# Altium schematic sheet Power.SchDoc
size A
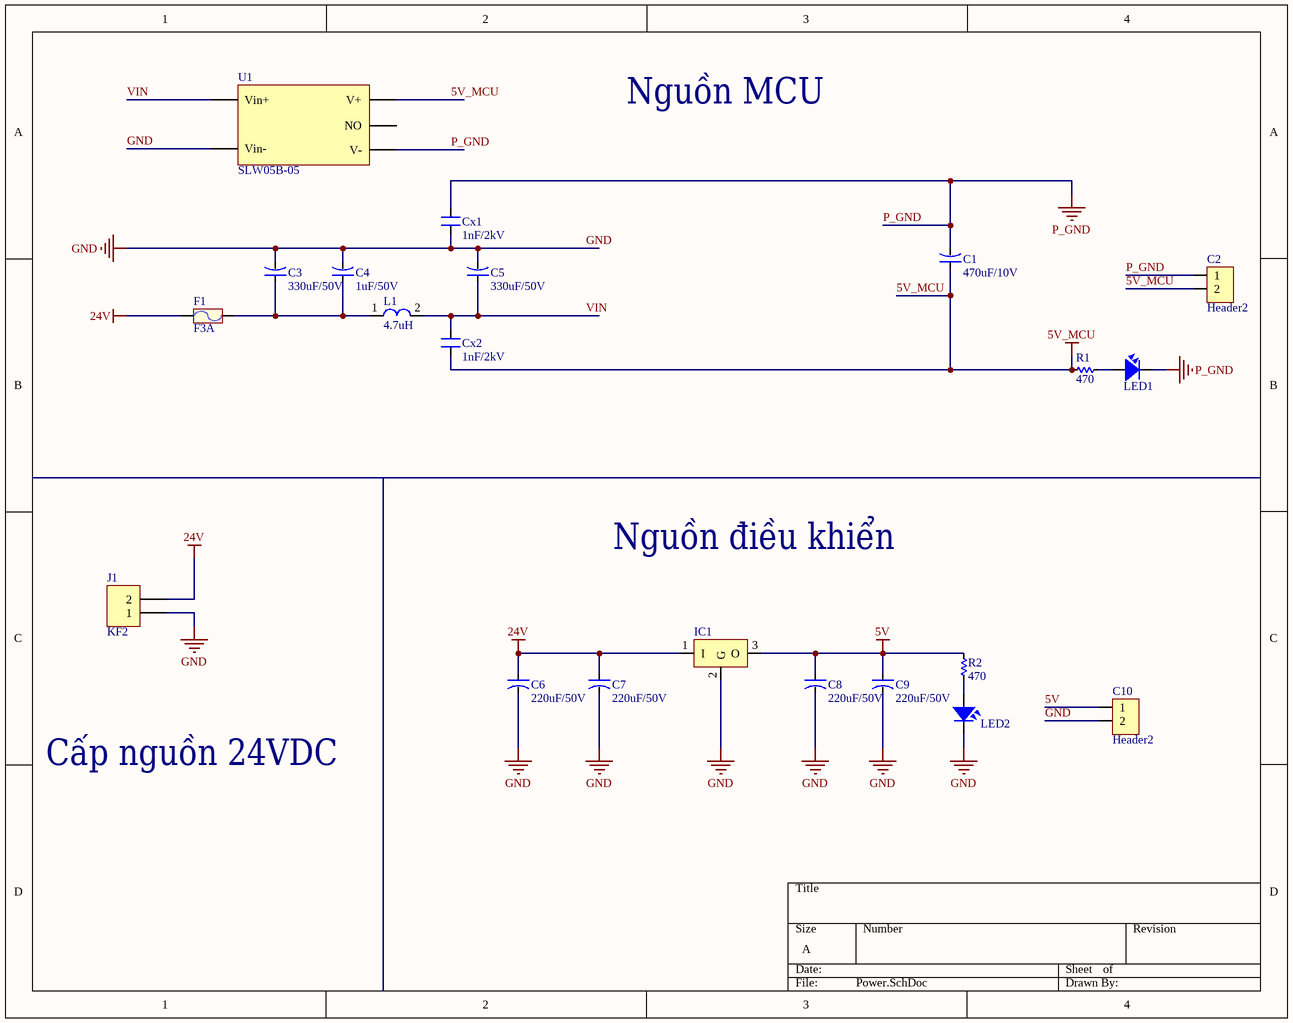
[diagram p0: Power.SchDoc]

## Parts
C1  470uF/10V  [TANTALUM-7343]
C2  Header2  [Header2]
C3  330uF/50V  [CAP-ALU-SMD-G]
C4  1uF/50V  [CAP-ALU-SMD-4.5x5x1.4]
C5  330uF/50V  [CAP-ALU-SMD-G]
C6  220uF/50V  [CAP-ALU-SMD-6.3x7.7x2.2]
C7  220uF/50V  [CAP-ALU-SMD-6.3x7.7x2.2]
C8  220uF/50V  [CAP-ALU-SMD-6.3x7.7x2.2]
C9  220uF/50V  [CAP-ALU-SMD-6.3x7.7x2.2]
C10  Header2  [Header2]
Cx1  1nF/2kV  [CN2-B]
Cx2  1nF/2kV  [CN2-B]
F1  F3A  [FUSE_SMD 1812]
IC1  LM7805  [TO252-123]  (value not drawn)
J1  KF2  [KF2-7.62]
L1  4.7uH  [L-SMD-M-12x10]
LED1  LED  [LED-1206-Red]  (value not drawn)
LED2  LED  [LED-1206-Red]  (value not drawn)
R1  470  [RES-SMD-0805]
R2  470  [RES-SMD-0805]
U1  SLW05B-05  [SLW05B-05]

## Nets
5V: C8.1 C9.1 C10.1 IC1.3(O) R2.1
5V_MCU: C1.1 C2.2 Cx2.1 R1.1 U1.V+
24V: C6.1 C7.1 F1.1 IC1.1(I) J1.2
GND: C3.2 C4.2 C5.2 C6.2 C7.2 C8.2 C9.2 C10.2 Cx1.1 IC1.2(G) J1.1 LED2.2 U1.Vin-
P_GND: C1.2 C2.1 Cx1.2 LED1.2 U1.V-
VIN: C5.1 Cx2.2 L1.2 U1.Vin+
NetC3_1: C3.1 C4.1 F1.2 L1.1
NetLED1_1: LED1.1 R1.2
NetLED2_1: LED2.1 R2.2

Not connected (* = marked no-connect by the designer): U1 NO

## Notes on the sheet
- Nguồn MCU
- Nguồn điều khiển
- Cấp nguồn 24VDC

## Library data of the parts
C1 = CN-TANTALUM-SMD: http://linhkienchatluong.vn/tu-tantalium/tu-tantalum-7343-477a-10v-470uf-73x43mm_sp460_ct1168.aspx
C2 = Header2: http://linhkienchatluong.vn/header-xh254-trang/header-duc-2p-xh254-2p-chan-thang-10c_sp861_ct1711.aspx; Manufacturer: W¨¹rth Elektronik eiSos GmbH; partNo: 613002143121; ComponentLink1 Description: Manufacturer; ComponentLink2 Description: Datasheet; NoPins: 02; Created Date: 29 March 2013; ComponentLink1URL: http://www.we-online.com; ComponentLink2URL: http://katalog.we-online.de/em/datasheet/6130xx143121.pdf; Created by: Karrer Zheng
C3 = CN-ALU-SMD: http://linhkienchatluong.vn/tu-nhom---tu-hoa-dan/tu-nhom-50v-330uf-10x102mm_sp455_ct2883.aspx; Published: 8-Jun-2000; LatestRevisionDate: 17-Jul-2002; LatestRevisionNote: Re-released for DXP Platform.; PackageReference: POLAR0.8; Publisher: Altium Limited
C4 = CN-ALU-SMD: http://linhkienchatluong.vn/tu-nhom---tu-hoa-dan/tu-nhom-50v-1uf-4x55mm_sp455_ct981.aspx; Published: 8-Jun-2000; LatestRevisionDate: 17-Jul-2002; LatestRevisionNote: Re-released for DXP Platform.; PackageReference: POLAR0.8; Publisher: Altium Limited
C5-C7 C9 = CN-ALU-SMD: Polarized Capacitor (Axial); Published: 8-Jun-2000; LatestRevisionDate: 17-Jul-2002; LatestRevisionNote: Re-released for DXP Platform.; PackageReference: POLAR0.8; Publisher: Altium Limited
C8 = CN-ALU-SMD: http://linhkienchatluong.vn/tu-nhom---tu-hoa-dan/tu-nhom-16v-220uf-63x77mm_sp455_ct964.aspx; Published: 8-Jun-2000; LatestRevisionDate: 17-Jul-2002; LatestRevisionNote: Re-released for DXP Platform.; PackageReference: POLAR0.8; Publisher: Altium Limited
C10 = Header2: Header IDC, 2 x 1 Pin Vertical 2.54mm Pitch (Non-Boxed, Male); Manufacturer: W¨¹rth Elektronik eiSos GmbH; partNo: 613002143121; ComponentLink1 Description: Manufacturer; ComponentLink2 Description: Datasheet; NoPins: 02; Created Date: 29 March 2013; ComponentLink1URL: http://www.we-online.com; ComponentLink2URL: http://katalog.we-online.de/em/datasheet/6130xx143121.pdf; Created by: Karrer Zheng
Cx1 Cx2 = CN: Value: 33pF
F1 = Fuse: http://linhkienchatluong.vn/cau-chi-su-smd-1808/cau-chi-su-smd-3a-125v-61x269mm-1808-fast-blow-fuse_sp1022_ct7321.aspx; Value: Fuse; Designed by: VanDungEvn
IC1 = LM78xx: http://linhkienchatluong.vn/ic-on-ap-78xx-79xx/78m05-05a-5v-to-252-chinh-hang-st_sp1000_ct8359.aspx; Note: Tab is connected to pin 3 (GND).; Published: 24-Aug-2001; LatestRevisionDate: 17-Jul-2002; LatestRevisionNote: Re-released for DXP Platform.; DatasheetVersion: Apr-1994; PackageVersion: Jul-1998; PackageReference: ISOWATT220AB; Publisher: Altium Limited; PackageDescription: TO, Thru-Hole, Vertical, Heatsink Mounted; 3 In-Line Leads; Pitch 2.54 mm; Pin sequence 1, 3, 2; ComponentLink1Description: Manufacturer Link; ComponentLink1URL: http://www.st.com/; ComponentLink2Description: Datasheet; ComponentLink2URL: http://www.st.com/stonline/products/literature/ds/2146/l78m05c.pdf
J1 = KF2: http://linhkienchatluong.vn/cau-dau-kf762/cau-dau-2p-kf762-2p-762mm-mau-den-loai-tot_sp871_ct5960.aspx; Manufacturer: Würth Elektronik eiSos GmbH; partNo: 691103110002; ComponentLink1 Description: Manufacturer; ComponentLink2 Description: Datasheet; NoPins: 2; Created Date: 29 October 2013; ComponentLink1URL: http://www.we-online.com; ComponentLink2URL: http://katalog.we-online.de/em/datasheet/6911031100xx.pdf; Created by: Karrer Zheng
L1 = L-SMD-1: http://linhkienchatluong.vn/cuon-cam-dan-cd127-12x12x7mm/cuon-cam-dan-cdrh127-47uh-4r7-3a-12x12x7mm_sp842_ct3447.aspx; partNo: 78477010; Manufacturer: Wurth Elektronik; Inductance: 1.0 μH; ComponentLink1Description: Manufacturer; ComponentLink1URL: http://www.we-online.de; Created by: Baojun Chen; Created Date: Nov.2015; ComponentLink2Description: Datasheet; ComponentLink2URL: http://katalog.we-online.de/pbs/datasheet/78477010.pdf
LED1 LED2 = LED SMD: Value: LED 3 - 5 ly 2 Colour
R1 R2 = Res-SMD: Resistor; Manufacturer: Generic Components; Class: Passive; Published: 08/06/2000; Publisher: Altium Hobart Technology Centre
U1 = Module DC-DC 220/5V/5W